# EAGLE design adaptor2 (EAGLE 6.5.0)
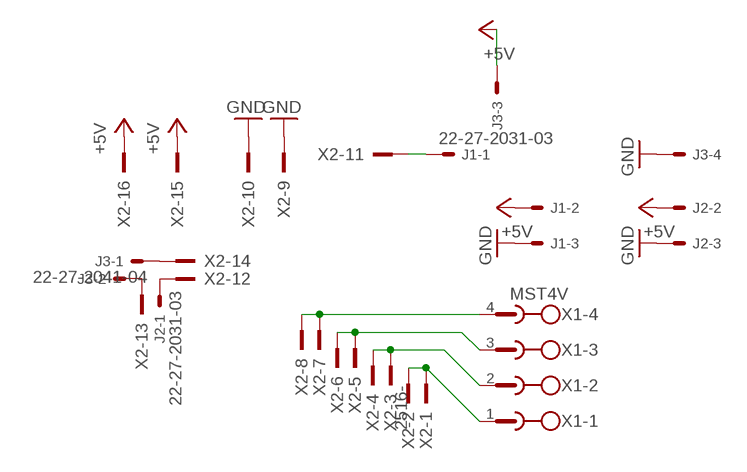
[diagram p0: schematic, sheet 1]

## Parts
J1  22-27-2031-03  [6410-03]
J2  22-27-2031-03  [6410-03]
J3  22-27-2041-04  [6410-04]
X1  MST4V  [MSTBV4]
X2  2516-  [PAK100/2500-16]

## Nets
+5V: J1.2 J2.2 J3.3 X2.15 X2.16
GND: J1.3 J2.3 J3.4 X2.9 X2.10
N$1: X1.4 X2.7 X2.8
N$2: X1.3 X2.5 X2.6
N$3: X1.2 X2.3 X2.4
N$4: X1.1 X2.1 X2.2
N$5: J1.1 X2.11
N$6: J3.1 X2.14
N$7: J2.1 X2.12
N$8: J3.2 X2.13

## Library data of the parts
J1 J2 = con-molex:22-?-03: CONNECTOR wire to board 2.54 mm (.1 inch) pitch header; OC_FARNELL: unknown; OC_NEWARK: unknown
J3 = con-molex:22-?-04: CONNECTOR wire to board 2.54 mm (.1 inch) pitch header; OC_FARNELL: unknown; OC_NEWARK: unknown
X1 = con-phoenix-508:MST4V: PHOENIX; OC_FARNELL: unknown; OC_NEWARK: unknown
X2 = con-3m:2516-: 3M (TM) Pak 100 4-Wall Header Source: 3M; OC_FARNELL: unknown; OC_NEWARK: unknown

## Board
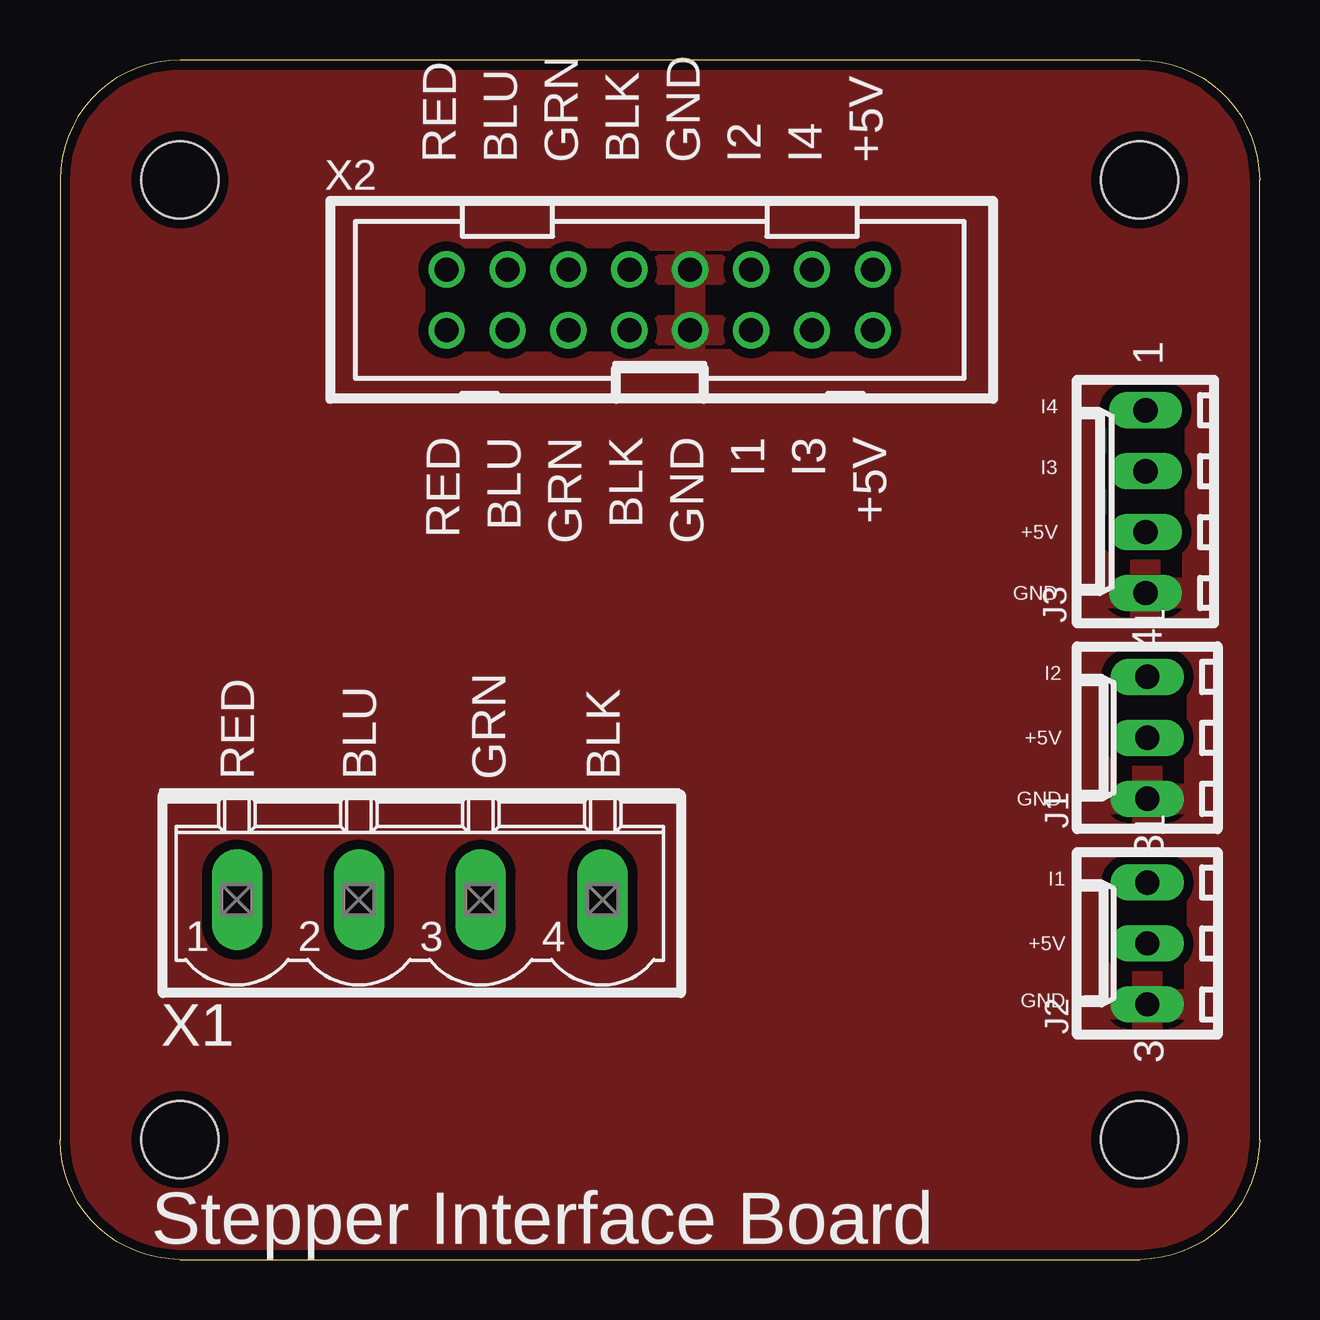
[diagram p1: board, top side]
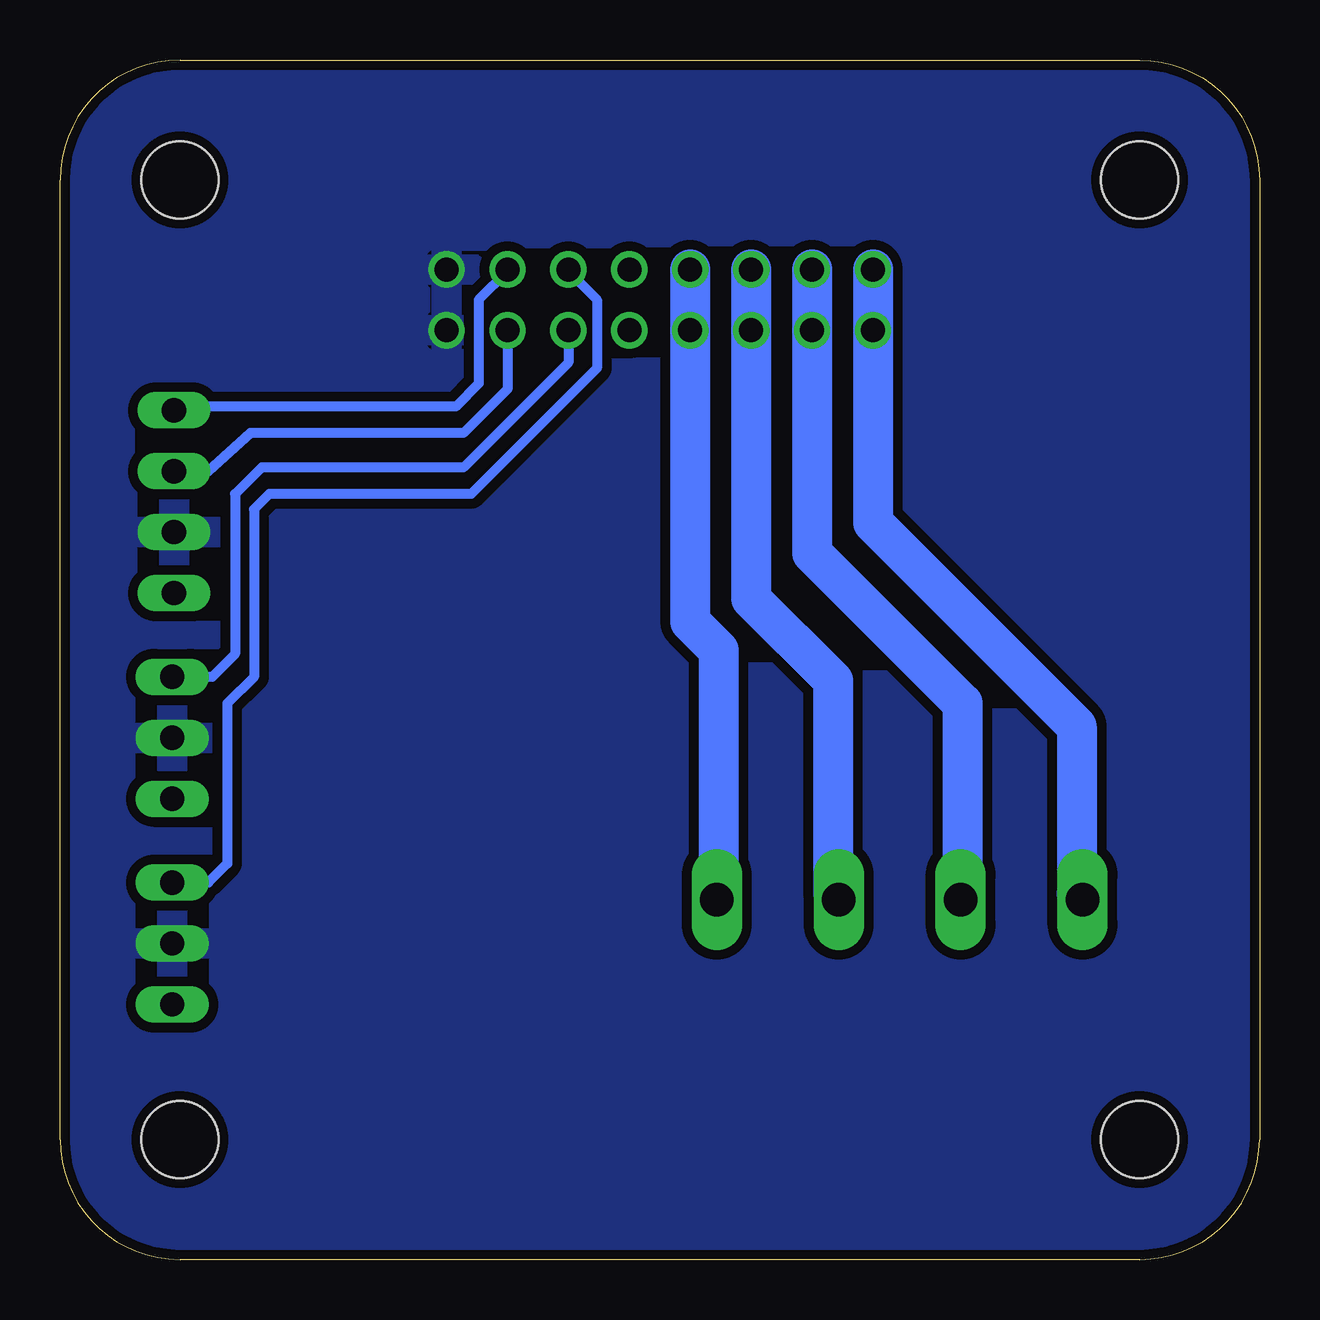
[diagram p2: board, bottom side, seen from below]

Size 50 x 50 mm. Coordinates in mm from the lower left corner, seen from the top.
Outline: 5,0 45,0 arc90 50,5 50,45 arc90 45,50 5,50 arc90 0,45 0,5 arc90 5,0
Copper layers (1*16): Top 0.035mm / dielectric 1.5mm / Bottom 0.035mm
Design rules "Seeed Fusion Design Rules": minimum track width 6mil, minimum drill 12mil, track to track 6mil, track to pad 6mil, pad to pad 6mil, via to via 6mil, smd to smd 0mil, copper to edge 10mil, drill to drill 10mil, minimum pad ring 10mil, minimum via ring 6mil, stop-mask expansion 2mil, vias tented up to drill 100mil, thermal gap 10mil
Holes 3.2 mm at 5,45 45,45 45,5 5,5

### Footprints (pad centres in the part's own frame; a part is rotated, then mirrored left to right if it is on the bottom)
6410-03 = drill 1.016 long: 1 2.54,0; 2 0,0; 3 -2.54,0
6410-04 = drill 1.016 long: 1 3.81,0; 2 1.27,0; 3 -1.27,0; 4 -3.81,0
MSTBV4 = drill 1.397 long: 1 -7.62,0; 2 -2.54,0; 3 2.54,0; 4 7.62,0
PAK100/2500-16 = drill 1 pad 1.422: 1 -8.89,-1.27; 2 -8.89,1.27; 3 -6.35,-1.27; 4 -6.35,1.27; 5 -3.81,-1.27; 6 -3.81,1.27; 7 -1.27,-1.27; 8 -1.27,1.27; 9 1.27,-1.27; 10 1.27,1.27; 11 3.81,-1.27; 12 3.81,1.27; 13 6.35,-1.27; 14 6.35,1.27; 15 8.89,-1.27; 16 8.89,1.27

### Placement (x,y rotation side)
J1  45.32,21.75 90 top
J2  45.32,13.18 90 top
J3  45.24,31.59 90 top
X1  15,15 0 top
X2  25,40 0 top

### Tracks (layer width: path | path; a pad name or v marks a point on that pad's centre or on a via)
+5V
  pour Bottom (isolate 0.406): -5,55 55,55 55,-7.5 -5,-7.5
GND
  pour Top (isolate 0.406): -2.5,52.5 52.5,52.5 52.5,-5 -2.5,-5
N$1
  Bottom 1.016: 22.54,15.08 X1.4
  Bottom 1.676: X2.8 X2.7 23.73,26.59 22.54,25.4 22.54,15.08
N$2
  Bottom 1.016: 17.78,15.24 X1.3
  Bottom 1.676: X2.6 X2.5 21.19,27.54 17.78,24.13 17.78,15.24
N$3
  Bottom 1.016: 12.38,15.08 X1.2
  Bottom 1.676: X2.4 X2.3 18.65,29.45 12.38,23.18 12.38,15.08
N$4
  Bottom 1.016: 7.62,15.24 X1.1
  Bottom 1.676: X2.2 X2.1 16.11,30.71 7.62,22.23 7.62,15.24
N$5
  Bottom 0.406: X2.11 28.81,37.39 33.18,33.02 41.59,33.02 42.7,31.91 42.7,25.24 43.66,24.29 J1.1
N$6
  Bottom 0.406: X2.14 31.35,41.2 32.54,40.01 32.54,36.51 33.5,35.56 45.09,35.56 J3.1
N$7
  Bottom 0.406: X2.12 28.81,41.19 27.62,40.01 27.62,37.15 32.86,31.91 41.27,31.91 41.91,31.27 41.91,24.29 43.02,23.18 43.02,16.51 43.81,15.72 J2.1
N$8
  Bottom 0.406: X2.13 31.35,36.28 33.18,34.45 42.07,34.45 43.81,32.86 J3.2

### Text on the board
_tsilk: RED | BLU | GRN | BLK | GND | I2 | I4 | +5V | I4 | RED | BLU | GRN | BLK | GND | I1 | I3 | +5V | I3 | +5V | GND | I2 | +5V | RED | BLU | GRN | BLK | GND | I1 | +5V | GND | Stepper Interface Board